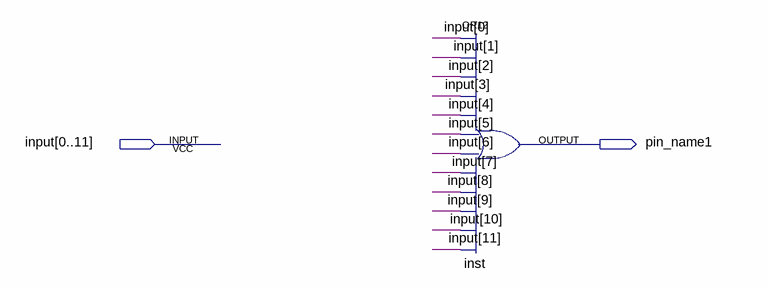
[diagram p0: schematic sheet]
// Quartus schematic or12_bus_input.bdf as structural Verilog: 1 symbols, 2 pins
module or12_bus_input (
  input  [0:11] \input ,
  output pin_name1
);

  or inst (pin_name1, \input [0], \input [1], \input [2], \input [3], \input [4], \input [5], \input [6], \input [7], \input [8], \input [9], \input [10], \input [11]);
endmodule
